# EAGLE design Baro_Touch (EAGLE 9.6.2)
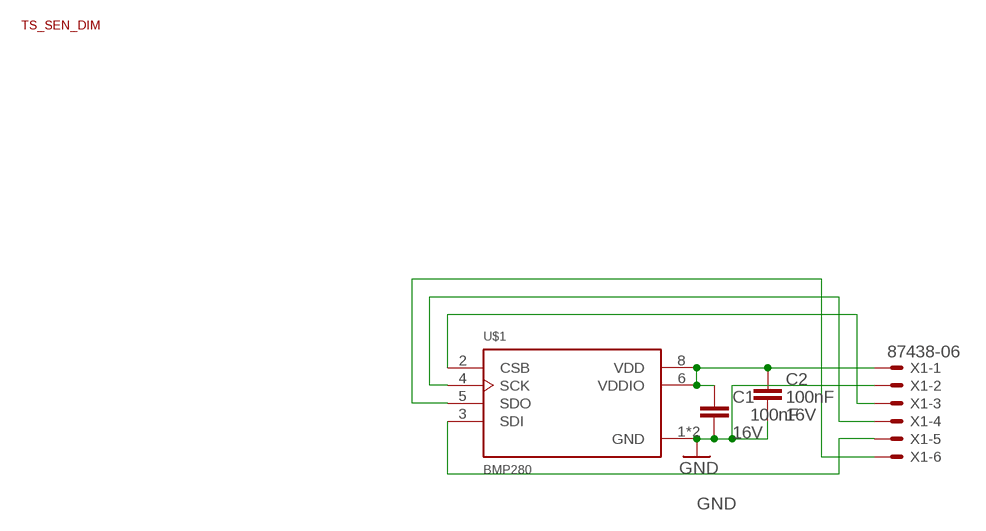
[diagram p0: schematic, sheet 1]

## Parts
C1  GCM155R71C104JA55  [C0402]
C2  GCM155R71C104JA55  [C0402]
DIMENSION1  TS_SEN_DIM  [SEN_DIM]
U$1  BMP280  [8-SMD]
X1  87438-06  [87438-06]

## Nets
GND: C1.2 C2.2 U$1.1(GND) U$1.7(GND) X1.2
N$1: C1.1 C2.1 U$1.6(VDDIO) U$1.8(VDD) X1.1
N$3: U$1.2(CSB) X1.3
N$4: U$1.4(SCK) X1.4
N$5: U$1.5(SDO) X1.6
N$6: U$1.3(SDI) X1.5

## Library data of the parts
C1 C2 = msrm:GCM?R7*: Multilayer Ceramic Capacitors Chip Multilayer Ceramic Capacitors for Automotive –55 to 125°C Sources: Catalogue <https://www.murata.com/~/media/webrenewal/support/library/catalog/products/capacitor/mlcc/c03e.ashx?la=en-us> Part Numbering <https://search.murata.co.jp/Ceramy/image/img/A01X/partnumbering_e_02.pdf>; CAPACITANCE: 100nF; DIGIKEY: 490-16433-1-ND; TOLERANCE: ±5%; VOLTAGE: 16V
DIMENSION1 = msrm:TS_SEN_DIM: DImetion drawing for Sonja's sensors
U$1 = msrm:BMP280
X1 = con-molex:87438-06: Wire-to-Board 1.50mm (.059") Pitch Header - Right Angle, SMT, Shrouded Source: http://www.molex.com/product/micro/87438.html; MF: MOLEX; MPN: 87438-0643; OC_FARNELL: 1756938; OC_NEWARK: 88K3155

## Board
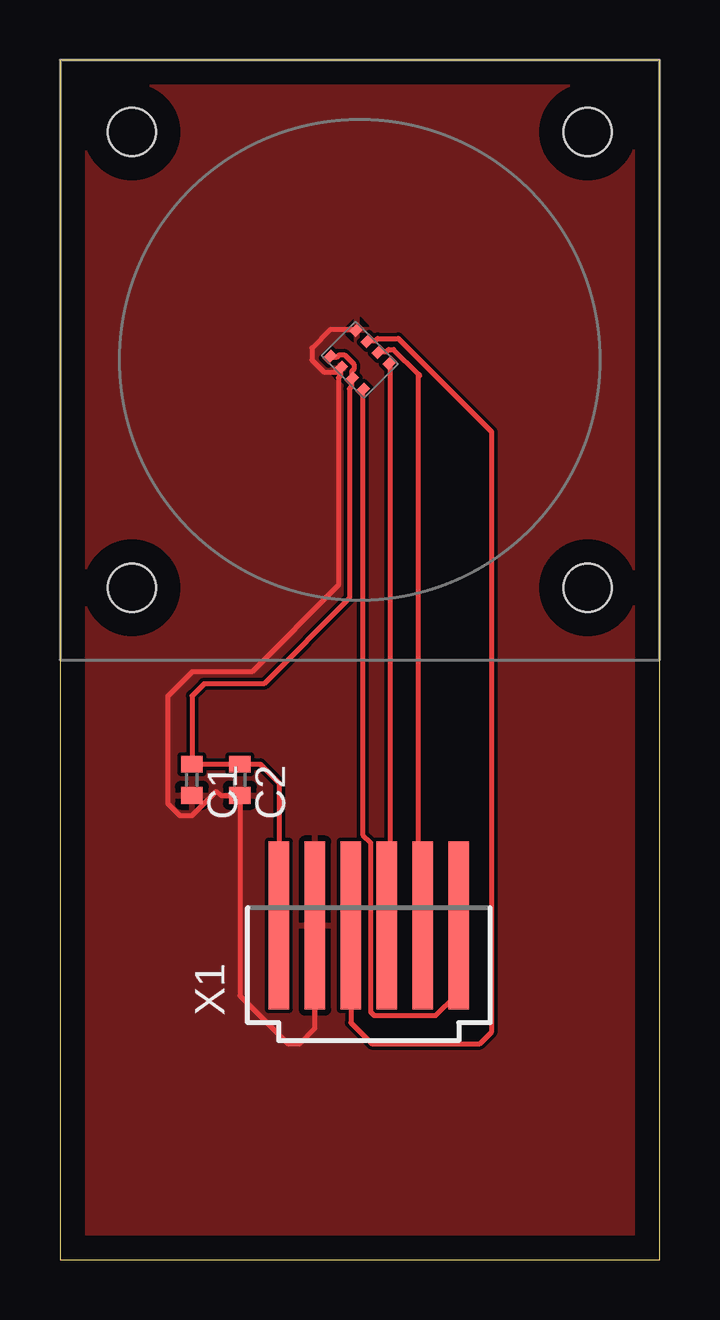
[diagram p1: board, top side]

Size 25 x 50 mm. Coordinates in mm from the lower left corner, seen from the top.
Outline: 0,0 25,0 25,50 0,50 0,0
Copper layers (1*16): Top 0.035mm / dielectric 1.5mm / Bottom 0.035mm
Design rules "default": minimum track width 6mil, minimum drill 0.35mm, track to track 6mil, track to pad 6mil, pad to pad 6mil, via to via 6mil, smd to smd 6mil, copper to edge 40mil, drill to drill 6mil, minimum pad ring 10mil, minimum via ring 8mil, stop-mask expansion 4mil, vias tented up to drill 0mil, thermal gap 10mil

### Footprints (pad centres in the part's own frame; a part is rotated, then mirrored left to right if it is on the bottom)
C0402 = smd 0.7 x 0.9: 1 -0.65,0; 2 0.65,0
SEN_DIM = hole 2: -9.5,9.5; 9.5,9.5; 9.5,-9.5; -9.5,-9.5
8-SMD = smd 0.5 x 0.35: 1 0.8,0.975; 2 0.8,0.325; 3 0.8,-0.325; 4 0.8,-0.975; 5 -0.8,-0.975; 6 -0.8,-0.325; 7 -0.8,0.325; 8 -0.8,0.975
87438-06 = smd 7 x 0.85: 1 0,3.75; 2 0,2.25; 3 0,0.75; 4 0,-0.75; 5 0,-2.25; 6 0,-3.75

### Placement (x,y rotation side)
C1  5.5,20 270 top
C2  7.5,20 270 top
DIMENSION1  12.5,37.5 0 top
U$1  12.5,37.5 45 top
X1  12.88,13.92 90 top

### Tracks (layer width: path | path; a pad name or v marks a point on that pad's centre or on a via)
GND
  Top 0.2: 5.96,18.96 C1.2 | X1.2 10.63,9.63 10,9 9.5,9 7.5,11 C2.2 6.7,19.35 6.51,19.51 5.96,18.96 | 5.96,18.96 5.5,18.5 5,18.5 4.5,19 4.5,23.5 5.5,24.5 8,24.5 11.61,28.11 11.61,36.76 11.71,36.85 11.71,37 | U$1.7 11.71,37 | U$1.1 11.26,38.76 10.5,38 10.5,37.5 11,37 11.71,37
  pour Top: 0,50 25,50 25,0 0,0
N$1
  Top 0.2: X1.1 9.13,19.87 8.35,20.65 C2.1 C1.1 5.5,23.5 6,24 8.5,24 12.07,27.57 12.07,36.3 12.16,36.39 U$1.6 12.16,37.02 12.26,37.11 12.26,37.32 11.86,37.72 11.65,37.72 11.56,37.62 U$1.8
N$3
  Top 0.2: U$1.2 13.15,38.3 13.24,38.39 14.11,38.39 18,34.5 18,9.5 17.5,9 13,9 12.13,9.87 X1.3 12,13.79
N$4
  Top 0.2: U$1.4 13.76,14.04 X1.4
N$5
  Top 0.2: U$1.5 12.62,17.71 12.95,17.38 12.95,10.31 13.1,10.17 15.66,10.17 16.49,11 16.5,11 16.63,11.13 X1.6
N$6
  Top 0.2: U$1.3 13.61,37.84 13.7,37.93 13.91,37.93 14.92,36.92 | 14.92,36.92 15,36.84 | 14.92,36.92 14.92,14.13 X1.5